# Altium schematic sheet Pi_Power.SchDoc
size A; SheetNumber: 3; SheetTotal: 3
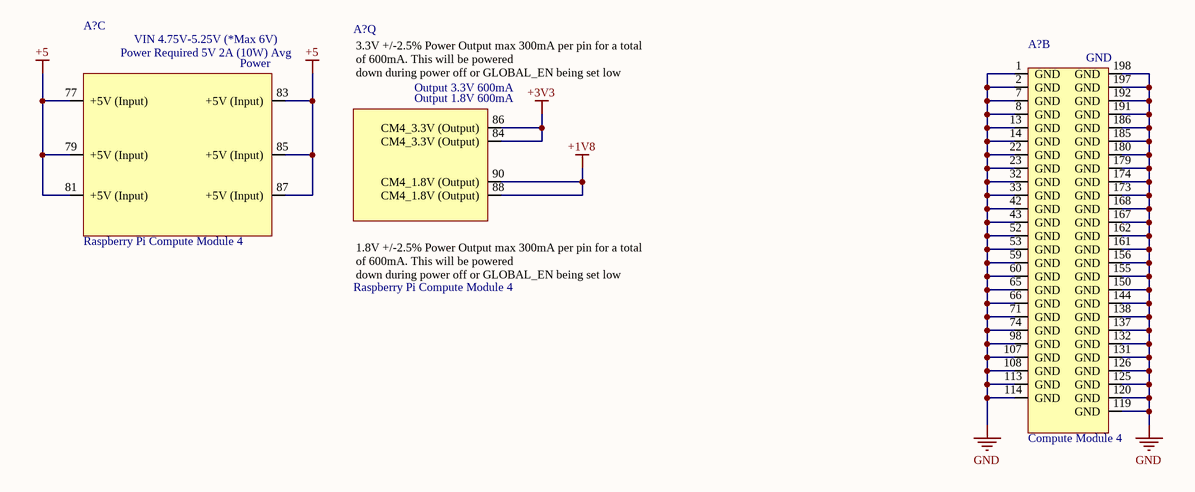
[diagram p0: Pi_Power.SchDoc]

## Parts
(Parts that share a designator on the sheet are numbered #1, #2 ... from top to bottom, then left to right.)
A?#1  Compute Module 4  [CM4-F40C-100DS-0.4v_1.5mm_0mm]  (part B of 21)  (no BOM)
A?#2  Raspberry Pi Compute Module 4  [CM4-F40C-100DS-0.4v_1.5mm_0mm]  (part C of 21)  (no BOM)
A?#3  Raspberry Pi Compute Module 4  [CM4-F40C-100DS-0.4v_1.5mm_0mm]  (part Q of 21)  (no BOM)

## Nets
+1V8: A?#3.88(CM4_1.8V_(Output)) A?#3.90(CM4_1.8V_(Output))
+3V3: A?#3.84(CM4_3.3V_(Output)) A?#3.86(CM4_3.3V_(Output))
+5: A?#2.77(+5V_(Input)) A?#2.79(+5V_(Input)) A?#2.81(+5V_(Input)) A?#2.83(+5V_(Input)) A?#2.85(+5V_(Input)) A?#2.87(+5V_(Input))
GND: A?#1.1(GND) A?#1.2(GND) A?#1.7(GND) A?#1.8(GND) A?#1.13(GND) A?#1.14(GND) A?#1.22(GND) A?#1.23(GND) A?#1.32(GND) A?#1.33(GND) A?#1.42(GND) A?#1.43(GND) A?#1.52(GND) A?#1.53(GND) A?#1.59(GND) A?#1.60(GND) A?#1.65(GND) A?#1.66(GND) A?#1.71(GND) A?#1.74(GND) A?#1.98(GND) A?#1.107(GND) A?#1.108(GND) A?#1.113(GND) A?#1.114(GND) A?#1.119(GND) A?#1.120(GND) A?#1.125(GND) A?#1.126(GND) A?#1.131(GND) A?#1.132(GND) A?#1.137(GND) A?#1.138(GND) A?#1.144(GND) A?#1.150(GND) A?#1.155(GND) A?#1.156(GND) A?#1.161(GND) A?#1.162(GND) A?#1.167(GND) A?#1.168(GND) A?#1.173(GND) A?#1.174(GND) A?#1.179(GND) A?#1.180(GND) A?#1.185(GND) A?#1.186(GND) A?#1.191(GND) A?#1.192(GND) A?#1.197(GND) A?#1.198(GND)

## Notes on the sheet
- (in symbol CM4, part C) VIN 4.75V-5.25V (*Max 6V); Power Required 5V 2A (10W) Avg; Power; by Amornthep Phunsin
- (in symbol CM4, part Q) 3.3V +/-2.5% Power Output max 300mA per pin for a total of 600mA. This will be powered / down during power off or GLOBAL_EN being set low; Output 3.3V 600mA; Output 1.8V 600mA; 1.8V +/-2.5% Power Output max 300mA per pin for a total of 600mA. This will be powered / down during power off or GLOBAL_EN being set low

## Library data of the parts
A?#1-A?#3 = CM4: Raspberry Pi Compute Module 4 by Amornthep Phunsin